# EAGLE schematic GPU_11_Bit_Counter (EAGLE 9.4.2)
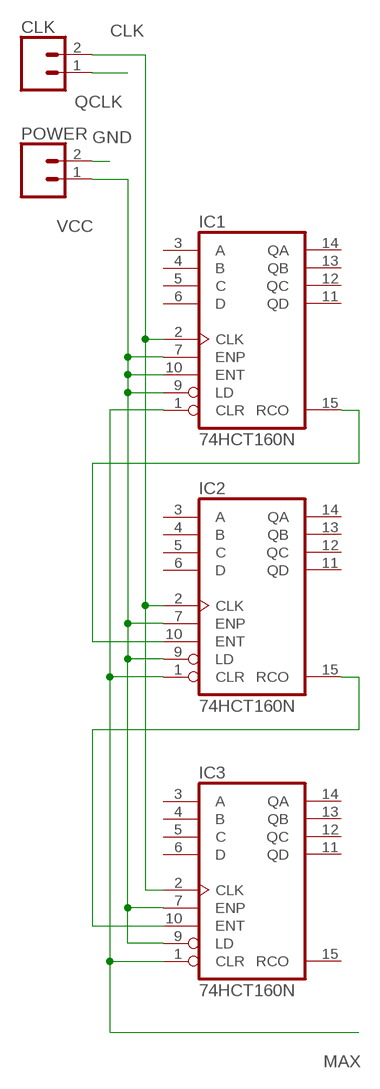
[diagram p0: schematic, sheet 1]

## Parts
CLK  CONN_02POGO_PIN_HOLES_ONLY  [1X02_PP_HOLES_ONLY]
IC1  74HCT160N  [DIL16]
IC2  74HCT160N  [DIL16]
IC3  74HCT160N  [DIL16]
POWER  CONN_02POGO_PIN_HOLES_ONLY  [1X02_PP_HOLES_ONLY]

## Nets
CLK: CLK.2 IC1.2(CLK) IC2.2(CLK) IC3.2(CLK)
GND: POWER.2
MAX: IC1.1(CLR) IC2.1(CLR) IC3.1(CLR)
N$3: IC1.15(RCO) IC2.10(ENT)
N$4: IC2.15(RCO) IC3.10(ENT)
QCLK: CLK.1
VCC: IC1.7(ENP) IC1.9(LD) IC1.10(ENT) IC2.7(ENP) IC2.9(LD) IC3.7(ENP) IC3.9(LD) POWER.1
Unconnected: IC1.3(A) IC1.4(B) IC1.5(C) IC1.6(D) IC1.11(QD) IC1.12(QC) IC1.13(QB) IC1.14(QA) IC2.3(A) IC2.4(B) IC2.5(C) IC2.6(D) IC2.11(QD) IC2.12(QC) IC2.13(QB) IC2.14(QA) IC3.3(A) IC3.4(B) IC3.5(C) IC3.6(D) IC3.11(QD) IC3.12(QC) IC3.13(QB) IC3.14(QA) IC3.15(RCO)

## Power pins joined to a net without a drawn wire
GND: IC1.8(GND) IC2.8(GND) IC3.8(GND)
VCC: IC1.16(VCC) IC2.16(VCC) IC3.16(VCC)

## Library data of the parts
CLK POWER = SparkFun-Connectors:CONN_02: Multi connection point. Often used as Generic Header-pin footprint for 0.1 inch spaced/style header connections On any of the 0.1 inch spaced packages, you can populate with these: Break Away Headers - Straight <https://www.sparkfun.com/products/116> (PRT-00116) Break Away Male Headers - Right Angle <https://www.sparkfun.com/products/553> (PRT-00553) Female Headers <https://www.sparkfun.com/products/115> (PRT-00115) Break Away Headers - Machine Pin <https://www.sparkfun.com/products/117> (PRT-00117) Break Away Female Headers - Swiss Machine Pin <https://www.sparkfun.com/products/743> (PRT-00743) For SCREWTERMINALS and SPRING TERMINALS visit here: Screw Terimnals on SparkFun.com <https://www.sparkfun.com/search/results?term=Screw+Terminals> (5mm/3.5mm/2.54mm spacing) This device is also useful as a general connection point to wire up your design to another part of your project. Our various solder wires solder well into these plated through hole pads. Hook-Up Wire - Assortment (Stranded, 22 AWG) <https://www.sparkfun.com/products/11375> (PRT-11375) Hook-Up Wire - Assortment (Solid Core, 22 AWG) <https://www.sparkfun.com/products/11367> (PRT-11367) View the entire wire category on our website here <https://www.sparkfun.com/categories/141> Special notes: Molex polarized connector foot print use with: PRT-08233 with associated crimp pins and housings. 2.54_SCREWTERM for use with PRT-10571. 3.5mm Screw Terminal footprints for PRT-08084 5mm Screw Terminal footprints for use with PRT-08432
IC1-IC3 = 74xx-eu:74*160: Synchronous 4-bit COUNTER